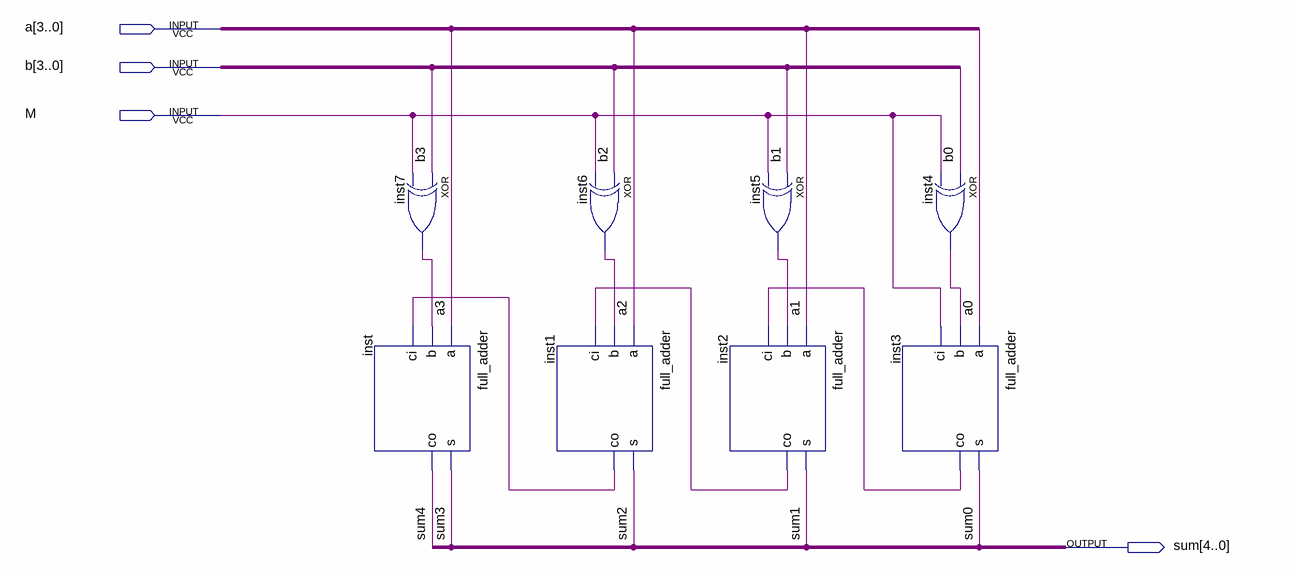
[diagram p0: schematic sheet]
// Quartus schematic fourbit_addsub_sime.bdf as structural Verilog: 8 symbols, 4 pins
module fourbit_addsub_sime (
  input  [3:0] a,
  input  [3:0] b,
  input  M,
  output [4:0] sum
);

  wire inst1_co, inst2_co, inst3_co, inst4_out, inst5_out, inst6_out, inst7_out;

  xor inst7 (inst7_out, b[3], M);
  full_adder inst (.a(a[3]), .b(inst7_out), .ci(inst1_co), .s(sum[3]), .co(sum[4]));
  xor inst6 (inst6_out, b[2], M);
  full_adder inst1 (.a(a[2]), .b(inst6_out), .ci(inst2_co), .s(sum[2]), .co(inst1_co));
  full_adder inst2 (.a(a[1]), .b(inst5_out), .ci(inst3_co), .s(sum[1]), .co(inst2_co));
  xor inst5 (inst5_out, b[1], M);
  full_adder inst3 (.a(a[0]), .b(inst4_out), .ci(M), .s(sum[0]), .co(inst3_co));
  xor inst4 (inst4_out, b[0], M);
endmodule
